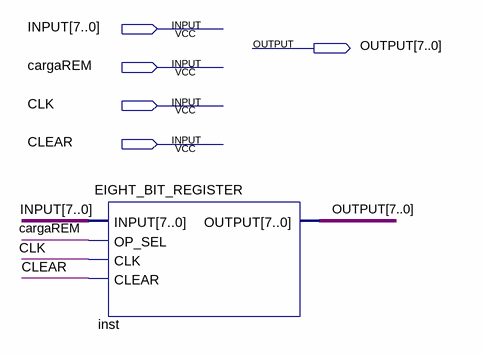
[diagram p0: schematic sheet]
// Quartus schematic REM.bdf as structural Verilog: 1 symbols, 5 pins
module REM (
  input  [7:0] INPUT,
  input  cargaREM,
  input  CLK,
  input  CLEAR,
  output [7:0] OUTPUT
);

  EIGHT_BIT_REGISTER inst (.INPUT(INPUT), .OP_SEL(cargaREM), .CLK(CLK), .CLEAR(CLEAR), .OUTPUT(OUTPUT));
endmodule
